# EAGLE board iv17-display-shield (EAGLE 7.5.0)
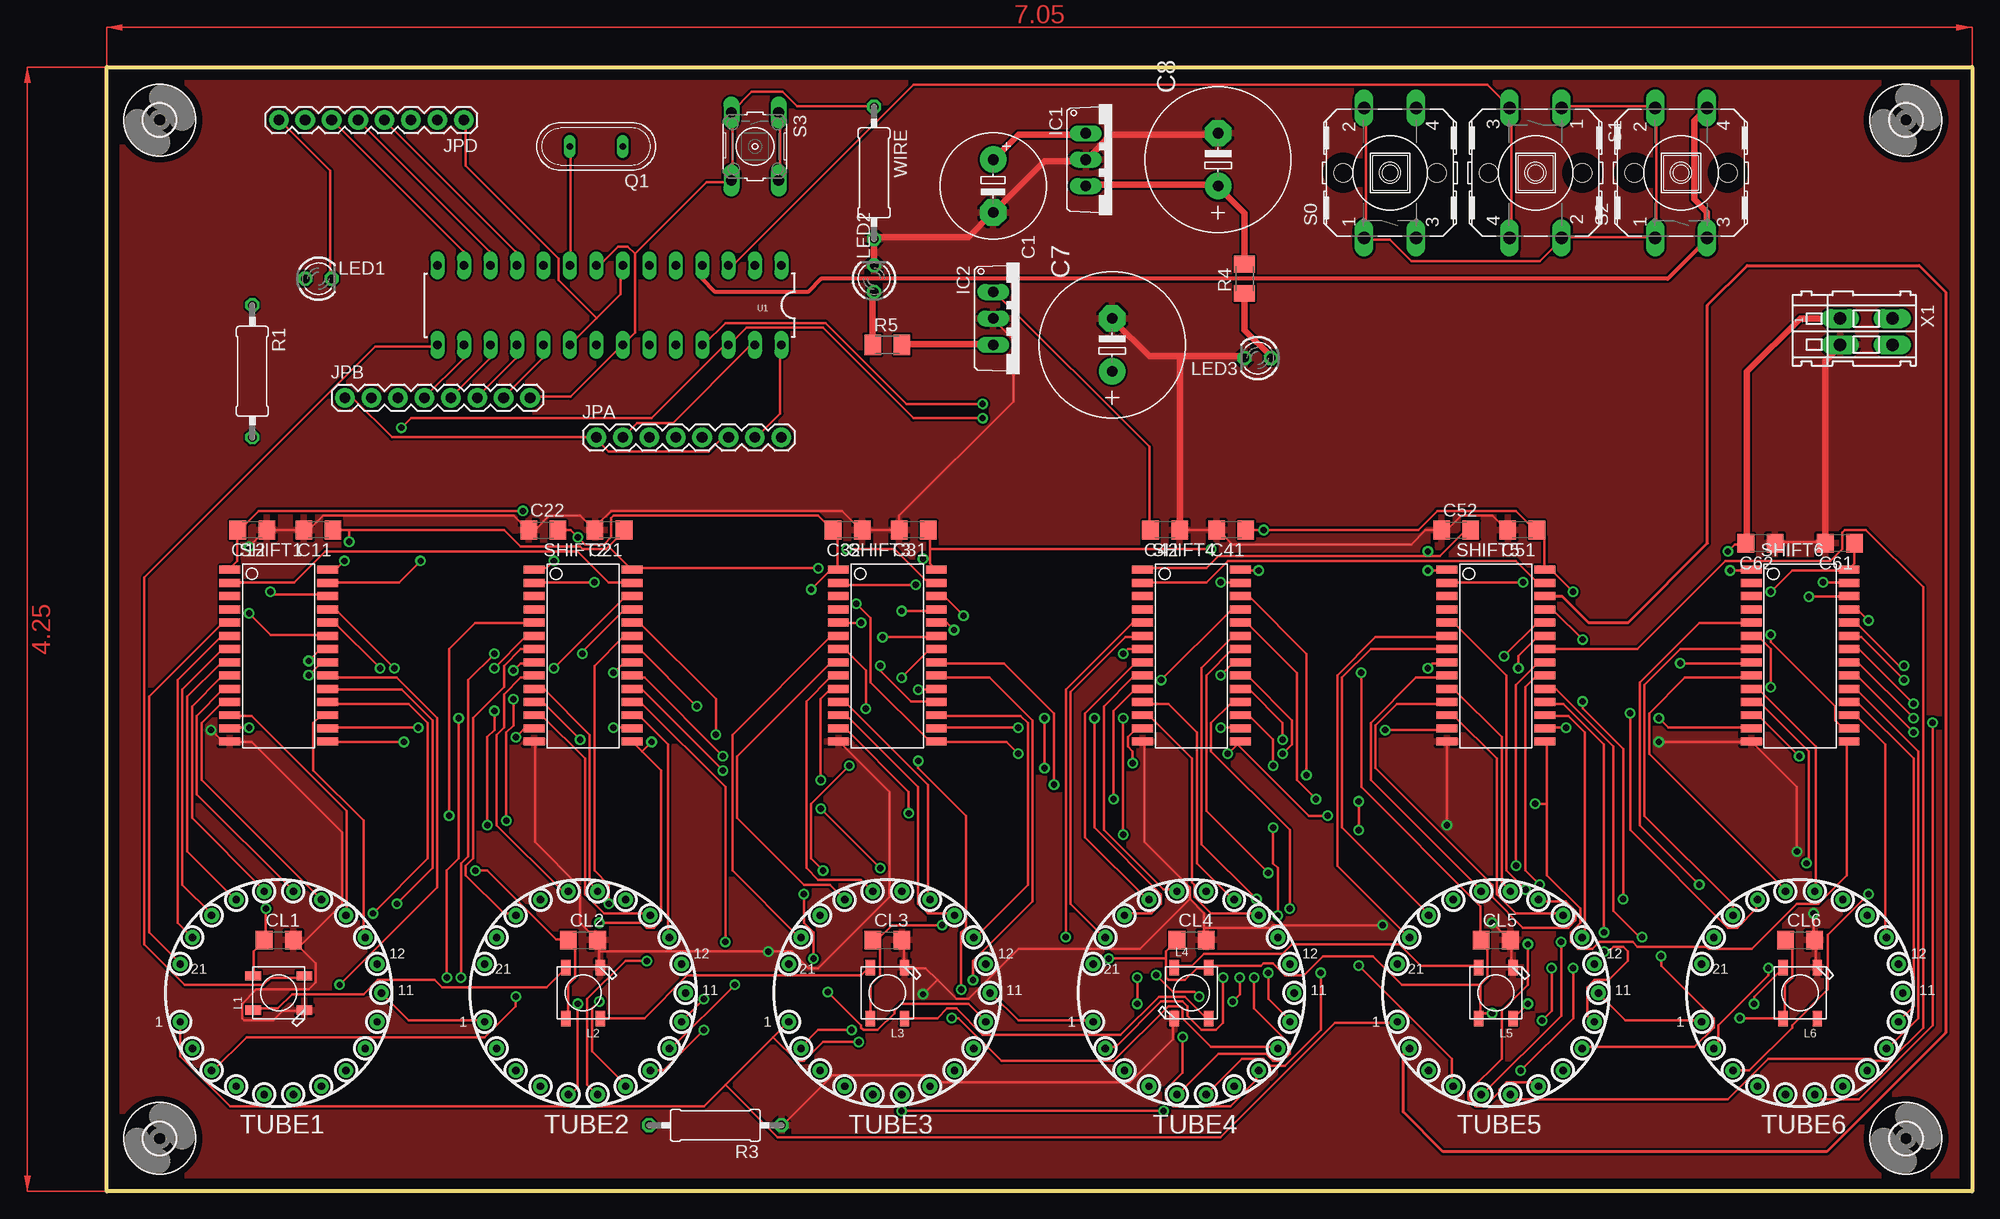
[diagram p2: board, top side]
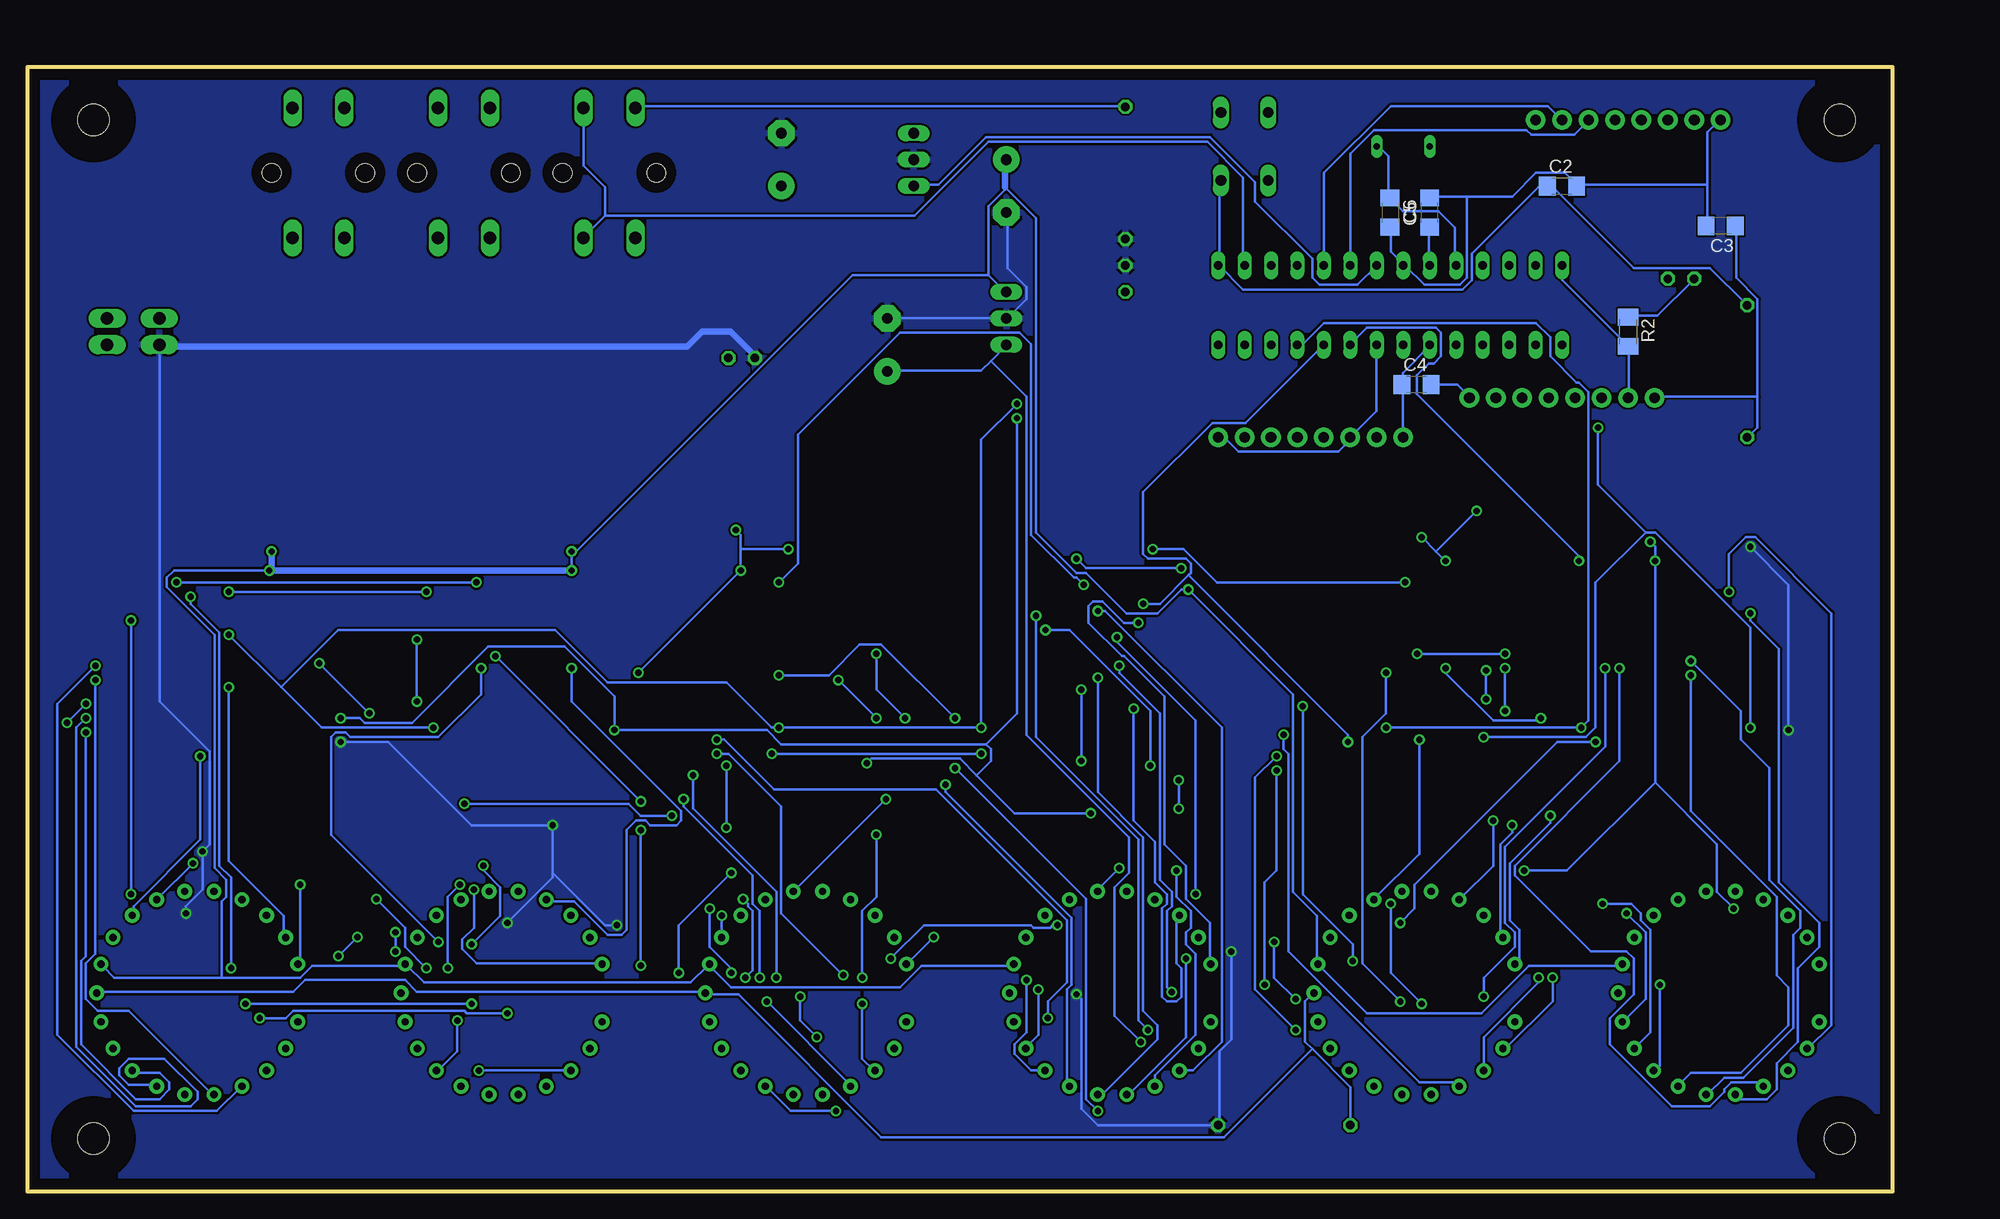
[diagram p3: board, bottom side, seen from below]

Size 179.07 x 107.95 mm. Coordinates in mm from the lower left corner, seen from the top.
Outline: 0,0 0,107.95 179.07,107.95 179.07,0 0,0
Copper layers (1*16): Top 0.035mm / dielectric 1.5mm / Bottom 0.035mm
Design rules "default": minimum track width 10mil, minimum drill 24mil, track to track 8mil, track to pad 8mil, pad to pad 8mil, via to via 8mil, smd to smd 8mil, copper to edge 40mil, drill to drill 8mil, minimum pad ring 10mil, minimum via ring 8mil, stop-mask expansion 4mil, vias tented up to drill 0mil, thermal gap 10mil

## Footprints (pad centres in the part's own frame; a part is rotated, then mirrored left to right if it is on the bottom)
E5-10,5 = drill 1.016 pad 2.54: + -2.54,0 | drill 1.016 pad 2.54 octagon: - 2.54,0
C1206 = smd 1.6 x 1.8: 1 -1.4,0; 2 1.4,0
E5-13 = drill 1.016 pad 2.54: + -2.54,0 | drill 1.016 pad 2.54 octagon: - 2.54,0
TO220V = drill 1.016 long: 1 -2.54,-2.54; 2 0,-2.54; 3 2.54,-2.54
1X08_ROUND = drill 1.016 pad 1.88: 1 0,0; 2 2.54,0; 3 5.08,0; 4 7.62,0; 5 10.16,0; 6 12.7,0; 7 15.24,0; 8 17.78,0
WS2812B = smd 1.5 x 0.9: 1-VDD 2.45,-1.65; 2-DOUT 2.45,1.65; 3-GND -2.45,1.65; 4-DIN -2.45,-1.65
LED3MM = drill 0.813 octagon: A -1.27,0; K 1.27,0
QS = drill 0.61 long: 1 -2.54,0; 2 2.54,0
0309/12 = drill 0.813 octagon: 1 -6.35,0; 2 6.35,0
M1206 = smd 1.6 x 2: 1 -1.4,0; 2 1.4,0
B3F-40XX = drill 1.194 long: 1 -6.248,2.489; 2 6.248,2.489; 3 -6.248,-2.489; 4 6.248,-2.489 | hole 1.803: 0,-4.496; 0,4.496
B3F-10XX = drill 1.016 long: 1 -3.251,2.261; 2 3.251,2.261; 3 -3.251,-2.261; 4 3.251,-2.261
SOIC-28W = smd 0.762 x 2: 1 -8.89,-4.7; 2 -7.62,-4.7; 3 -6.35,-4.7; 4 -5.08,-4.7; 5 -3.81,-4.7; 6 -2.54,-4.7; 7 -1.27,-4.7; 8 0,-4.7; 9 1.27,-4.7; 10 2.54,-4.7; 11 3.81,-4.7; 12 5.08,-4.7; 13 6.35,-4.7; 14 7.62,-4.7; 15 7.62,4.7; 16 6.35,4.7; 17 5.08,4.7; 18 3.81,4.7; 19 2.54,4.7; 20 1.27,4.7; 21 0,4.7; 22 -1.27,4.7; 23 -2.54,4.7; 24 -3.81,4.7; 25 -5.08,4.7; 26 -6.35,4.7; 27 -7.62,4.7; 28 -8.89,4.7
NIXIE-22 = drill 0.7 pad 1.422: 1 -9.451,-2.775; 2 -8.287,-5.325; 3 -6.45,-7.444; 4 -4.092,-8.96; 5 -1.402,-9.75; 6 1.402,-9.75; 7 4.092,-8.96; 8 6.45,-7.444; 9 8.287,-5.325; 10 9.451,-2.775; 11 9.85,0; 12 9.451,2.775; 13 8.287,5.325; 14 6.45,7.444; 15 4.092,8.96; 16 1.402,9.75; 17 -1.402,9.75; 18 -4.092,8.96; 19 -6.45,7.444; 20 -8.287,5.325; 21 -9.451,2.775
DIL28-3 = drill 0.813 long: 1 -16.51,-3.81; 2 -13.97,-3.81; 3 -11.43,-3.81; 4 -8.89,-3.81; 5 -6.35,-3.81; 6 -3.81,-3.81; 7 -1.27,-3.81; 8 1.27,-3.81; 9 3.81,-3.81; 10 6.35,-3.81; 11 8.89,-3.81; 12 11.43,-3.81; 13 13.97,-3.81; 14 16.51,-3.81; 15 16.51,3.81; 16 13.97,3.81; 17 11.43,3.81; 18 8.89,3.81; 19 6.35,3.81; 20 3.81,3.81; 21 1.27,3.81; 22 -1.27,3.81; 23 -3.81,3.81; 24 -6.35,3.81; 25 -8.89,3.81; 26 -11.43,3.81; 27 -13.97,3.81; 28 -16.51,3.81
3,0 = hole 3: 0,0
233-102 = drill 1.2 long: A1 -1.25,2.5; A2 1.25,2.5; B1 -1.25,-2.5; B2 1.25,-2.5

## Placement (x,y rotation side)
C1  470uf  [E5-10,5]  85.09,96.52 270 top
C2  0.1uF  [C1206]  31.75,96.52 0 bottom
C3  0.1uF  [C1206]  16.51,92.71 180 bottom
C4  0.1uF  [C1206]  45.72,77.47 0 bottom
C5  6pF  [C1206]  44.45,93.98 90 bottom
C6  6pF  [C1206]  48.26,93.98 270 bottom
C7  [E5-13]  96.52,81.28 90 top
C8  [E5-13]  106.68,99.06 90 top
C11  100nf  [C1206]  20.32,63.5 180 top
C12  100nf  [C1206]  13.97,63.5 180 top
C21  100nf  [C1206]  48.26,63.5 180 top
C22  100nf  [C1206]  41.91,63.5 0 top
C31  100nf  [C1206]  77.47,63.5 180 top
C32  100nf  [C1206]  71.12,63.5 180 top
C41  100nf  [C1206]  107.95,63.5 180 top
C42  100nf  [C1206]  101.6,63.5 180 top
C51  100nf  [C1206]  135.89,63.5 180 top
C52  100nf  [C1206]  129.54,63.5 0 top
C61  100nf  [C1206]  166.37,62.23 180 top
C62  100nf  [C1206]  158.75,62.23 180 top
CL1  100nf  [C1206]  16.51,24.13 0 top
CL2  100nf  [C1206]  45.72,24.13 0 top
CL3  100nf  [C1206]  74.93,24.13 0 top
CL4  100nf  [C1206]  104.14,24.13 0 top
CL5  100nf  [C1206]  133.35,24.13 0 top
CL6  100nf  [C1206]  162.56,24.13 0 top
IC1  MURATA 5V  [TO220V]  96.52,99.06 270 top
IC2  MURATA 5V  [TO220V]  87.63,83.82 270 top
JPA  [1X08_ROUND]  46.99,72.39 0 top
JPB  [1X08_ROUND]  22.86,76.2 0 top
JPD  [1X08_ROUND]  34.29,102.87 180 top
L1  WS2812B  [WS2812B]  16.51,19.05 180 top
L2  WS2812B  [WS2812B]  45.72,19.05 270 top
L3  WS2812B  [WS2812B]  74.93,19.05 270 top
L4  WS2812B  [WS2812B]  104.14,19.05 90 top
L5  WS2812B  [WS2812B]  133.35,19.05 270 top
L6  WS2812B  [WS2812B]  162.56,19.05 270 top
LED1  heart  [LED3MM]  20.32,87.63 0 top
LED2  5vfil  [LED3MM]  73.66,87.63 90 top
LED3  5v1  [LED3MM]  110.49,80.01 180 top
Q1  [QS]  46.99,100.33 180 top
R1  4.7K  [0309/12]  13.97,78.74 270 top
R2  [M1206]  25.4,82.55 270 bottom
R3  [0309/12]  58.42,6.35 180 top
R4  [M1206]  109.22,87.63 90 top
R5  [M1206]  74.93,81.28 0 top
S0  [B3F-40XX]  123.19,97.79 90 top
S1  [B3F-40XX]  137.16,97.79 270 top
S2  [B3F-40XX]  151.13,97.79 90 top
S3  [B3F-10XX]  62.23,100.33 270 top
SHIFT1  MAX6921  [SOIC-28W]  16.51,50.8 270 top
SHIFT2  MAX6921  [SOIC-28W]  45.72,50.8 270 top
SHIFT3  MAX6921  [SOIC-28W]  74.93,50.8 270 top
SHIFT4  MAX6921  [SOIC-28W]  104.14,50.8 270 top
SHIFT5  MAX6921  [SOIC-28W]  133.35,50.8 270 top
SHIFT6  MAX6921  [SOIC-28W]  162.56,50.8 270 top
TUBE1  IV17  [NIXIE-22]  16.51,19.05 0 top
TUBE2  IV17  [NIXIE-22]  45.72,19.05 0 top
TUBE3  IV17  [NIXIE-22]  74.93,19.05 0 top
TUBE4  IV17  [NIXIE-22]  104.14,19.05 0 top
TUBE5  IV17  [NIXIE-22]  133.35,19.05 0 top
TUBE6  IV17  [NIXIE-22]  162.56,19.05 0 top
U1  ATMEGA328P_PDIP  [DIL28-3]  48.26,85.09 180 top
U$1  [3,0]  172.72,102.87 0 top
U$2  [3,0]  172.72,5.08 0 top
U$3  [3,0]  5.08,102.87 0 top
U$4  [3,0]  5.08,5.08 0 top
WIRE  wire  [0309/12]  73.66,97.79 270 top
X1  24vdc  [233-102]  168.91,82.55 270 top

## Tracks (layer width: path | path; a pad name or v marks a point on that pad's centre or on a via)
5VDC  (via drill 0.61)
  Top 0.254: CL6.1 161.34,23.95 161.8,23.49 161.8,20.52 161.11,19.84 161.11,16.64 L6.1-VDD 160.88,16.64 v156.77,16.64 | L3.1-VDD 73.33,16.64 73.33,19.84 74.24,20.75 74.24,23.27 73.56,23.95 CL3.1 73.56,24.18 74.02,24.18 75.39,25.55 v80.19,25.55 | 101.68,22.35 101.68,23.04 102.59,23.95 CL4.1 | 101.68,22.35 101.68,20.52 101.91,20.3 103.5,20.3 104.65,21.44 105.56,21.44 L4.1-VDD 105.79,21.67 110.82,21.67 111.05,21.89 111.96,21.89 113.11,20.75 114.93,20.75 116.76,22.58 121.56,22.58 124.31,19.84 131.85,19.84 | 131.85,19.84 131.85,17.09 | 131.85,17.09 131.85,16.64 L5.1-VDD 131.85,17.09 | 131.85,19.84 132.54,20.52 132.54,23.49 132.08,23.95 CL5.1 131.85,24.18 131.85,27.38 120.42,38.81 v120.42,49.78 | 101.68,22.35 v96.19,22.35 | 131.85,17.09 v132.99,17.09 | L2.1-VDD 44.3,16.64 44.3,19.84 44.98,20.52 44.98,23.49 44.53,23.95 CL2.1 44.3,24.18 43.16,24.18 36.52,30.81 v35.38,30.81 | L1.1-VDD 14.12,20.75 14.12,23.04 15.04,23.95 CL1.1 15.26,24.18 v15.26,27.15 | 23.27,63.5 38.12,63.5 39.73,61.9 45.44,61.9 45.67,61.67 47.95,61.67 48.18,61.9 | 23.27,63.5 C11.1 | 48.18,61.9 49.78,63.5 C21.1 | v22.81,60.53 22.12,59.84 21.44,59.84 SHIFT1.28 | 23.27,63.5 v23.27,62.36 | 48.18,61.9 50.24,59.84 SHIFT2.28 50.47,59.84 v68.3,59.84 | 79.04,60.76 79.04,60.3 79.5,59.84 SHIFT3.28 | 79.04,60.76 79.04,61.67 | 79.04,61.67 79.04,63.5 C31.1 | C61.1 167.74,62.13 167.74,60.3 167.28,59.84 SHIFT6.28 167.06,59.61 161.8,59.61 v159.74,57.56 | C41.1 v111.05,63.5 125.91,63.5 127.74,65.33 135.28,65.33 137.11,63.5 C51.1 137.34,63.5 138.02,62.81 138.02,59.84 SHIFT5.28 138.25,59.61 138.71,59.61 v140.77,57.56
  Top 0.254: v110.59,59.61 108.99,59.61 SHIFT4.28 | v106.02,61.67 79.04,61.67 | 79.04,60.76 v78.36,60.76
  Bottom 0.254: v80.19,25.55 80.64,25.55 80.87,25.32 82.47,25.32 82.7,25.55 92.99,25.55 v96.19,22.35 | v156.77,16.64 154.25,16.64 153.57,17.32 137.11,17.32 136.88,17.09 v132.99,17.09 | v23.27,62.36 22.81,61.9 v22.81,60.53 22.81,39.27 | v15.26,27.15 16.87,28.75 16.87,33.33 22.81,39.27 | v35.38,30.81 31.27,30.81 22.81,39.27 | 110.59,61.67 110.59,63.04 v111.05,63.5 | 110.59,61.67 v110.59,59.61 v120.42,49.78 | v140.77,57.56 v159.74,57.56 | 110.59,61.67 v106.02,61.67 | v68.3,59.84 77.44,59.84 v78.36,60.76
24VDC  (via drill 0.61)
  Top 0.254: SHIFT1.1 11.84,59.84 12.52,60.53 12.52,63.5 C12.2 12.75,63.5 14.58,65.33 v39.95,65.33 | C22.2 44.53,63.5 v45.21,62.81 45.9,62.13 47.73,62.13 48.41,62.81 48.41,64.64 48.64,64.87 68.3,64.87 69.67,63.5 C32.2 69.9,63.5 70.13,63.27 70.13,59.84 SHIFT3.1 70.13,59.61 69.44,59.61 v67.61,57.79 | v42.93,60.53 42.24,59.84 41.1,59.84 SHIFT2.1 | 93.9,101.45 IC1.1 | 85.22,99.16 C1.+ | C42.2 100.08,63.5 100.08,71.5 85.22,86.36 IC2.1 | 157.45,62.36 C62.2 157.23,62.13 156.31,62.13 v155.63,61.44 | C52.2 130.48,63.5 127.96,60.98 126.82,60.98 | 126.82,60.98 106.7,60.98 105.56,59.84 99.62,59.84 SHIFT4.1 | v126.82,59.61 128.42,59.61 SHIFT5.1 | 126.82,60.98 v126.82,61.44 | v155.85,59.61 157.68,59.61 SHIFT6.1
  Top 0.61: 93.9,101.45 87.5,101.45 85.22,99.16 | 157.45,62.36 157.45,78.71 162.56,83.82 166.39,83.82 X1.B1
  Bottom 0.254: TUBE1.12 26.01,21.67 34.92,21.67 39.5,17.09 50.47,17.09 55.04,21.67 TUBE2.12 55.27,21.89 55.27,26.47 57.56,28.75 57.56,47.73 v67.61,57.79 68.3,57.79 70.59,55.5 73.56,55.5 77.44,59.38 78.36,59.38 82.24,63.27 82.24,93.45 85.22,96.42 85.22,96.19 86.82,94.59 86.82,87.96 | v45.21,62.81 43.84,61.44 | 43.84,61.44 v42.93,60.53 | 43.84,61.44 v39.95,65.33 | 160.43,20.52 170.71,20.52 171.86,21.67 TUBE6.12 | 160.43,20.52 152.88,20.52 151.74,21.67 142.82,21.67 TUBE5.12 142.6,21.67 141,20.07 115.39,20.07 113.79,21.67 TUBE4.12 113.56,21.67 111.51,19.61 95.27,19.61 93.22,21.67 84.53,21.67 TUBE3.12 | 86.82,87.96 85.22,86.36 IC2.1 | 85.22,98.93 C1.+ | 126.82,60.98 v126.82,59.61 | 155.63,59.61 v155.85,59.61 165,59.61 165.68,58.93 165.68,58.01 161.11,53.44 161.11,31.04 159.97,29.9 159.97,28.3 160.43,27.84 160.43,20.52 | 86.82,87.96 99.85,87.96 126.82,60.98 | 126.82,60.98 v126.82,61.44
  Bottom 0.61: 85.22,96.42 85.22,98.93 | v126.82,59.61 155.63,59.61 v155.63,61.44
AGND  (via drill 0.61)
  Top 0.254: L4.3-GND 102.36,16.41 102.36,14.58 98.25,10.46 80.19,10.46 79.5,11.15 69.67,11.15 64.87,6.35 R3.1 | 47.27,23.04 47.27,23.95 CL2.2 47.04,24.18 45.44,25.78 45.44,29.21 41.1,33.55 41.1,43.16 SHIFT2.14 | 47.27,23.04 47.27,21.67 L2.3-GND | 47.27,23.04 v63.5,23.04 65.79,23.04 67.39,21.44 68.3,21.44 75.16,28.3 75.16,38.35 70.36,43.16 SHIFT3.14 | CL3.2 76.53,23.95 76.53,21.67 L3.3-GND 76.76,21.44 78.59,21.44 79.73,20.3 | 105.33,25.32 105.33,26.7 103.96,28.07 | 105.33,25.32 105.33,24.18 CL4.2 | 103.96,28.07 103.96,29.21 99.62,33.55 99.62,43.16 SHIFT4.14 | 79.73,20.3 81.56,18.47 82.7,18.47 87.5,23.27 99.16,23.27 103.96,28.07 | C62.1 160.2,62.36 164.77,62.36 C61.2 165,62.36 | 166.37,81.1 X1.B2 | L6.3-GND 164.08,21.67 164.08,23.95 CL6.2 163.85,24.18 v163.85,26.7 | L5.3-GND 134.82,21.67 134.82,23.95 CL5.2 134.59,24.18 v132.99,25.78 | v128.65,35.15 128.65,43.16 SHIFT5.14 | v149,43.16 157.68,43.16 SHIFT6.14 157.91,43.16 162.25,38.81 v162.25,32.64 | 105.33,25.32 111.73,25.32 111.96,25.55 v122.48,25.55 | 79.73,20.3 v78.36,18.92 | C51.2 134.37,63.5 132.99,64.87 130.02,64.87 128.65,63.5 C52.1 126.59,63.5 125.22,62.13 108.08,62.13 106.7,63.5 C41.2 103.05,63.5 C42.1 | 109.22,80.19 LED3.K | 96.65,83.62 C7.- | 93.9,98.93 IC1.2 94.13,99.16 | 85.22,94.13 C1.- 84.99,93.9 | 73.79,91.62 WIRE.2 | 106.48,101.45 C8.- | 18.47,23.49 18.01,23.95 CL1.2 18.47,23.49 | 18.47,23.49 20.07,21.89 20.07,20.07 19.38,19.38 14.35,19.38 12.98,18.01 12.98,16.64 13.21,16.41 15.95,16.41 16.87,17.32 18.92,17.32 L1.3-GND | 18.47,23.49 22.58,27.61 22.58,34.47 13.89,43.16 11.84,43.16 SHIFT1.14 11.61,43.38 10.92,43.38 v10.01,44.3
  Top 0.254: IC2.2 85.22,83.62 87.05,81.79 87.05,75.84 76.07,64.87 C31.2 C32.1 72.41,63.5 70.59,65.33 48.41,65.33 47.04,63.96 47.04,63.5 C21.2 46.81,63.5 45.44,64.87 42.47,64.87 41.1,63.5 C22.1 40.41,63.5 39.04,64.87 20.75,64.87 19.38,63.5 C11.2 C12.1 15.26,63.5 v13.66,61.9
  Top 0.61: 165,62.36 165,79.73 166.37,81.1 | 103.05,80.19 100.08,80.19 96.65,83.62 | 103.05,80.19 109.22,80.19 | 103.05,80.19 103.05,63.5 | 93.9,98.93 90.02,98.93 85.22,94.13 | 73.79,91.62 82.7,91.62 84.99,93.9 | 106.48,101.45 96.42,101.45 94.13,99.16 | LED2.K WIRE.2
  Bottom 0.254: v63.5,23.04 63.5,14.58 64.64,13.44 64.64,6.35 R3.1 76.3,6.35 77.9,7.95 77.9,18.47 v78.36,18.92 | 128.65,30.58 128.65,30.12 v132.99,25.78 | 128.65,30.58 v128.65,35.15 136.42,35.15 144.42,43.16 v149,43.16 | v163.85,26.7 163.85,27.38 162.25,28.98 v162.25,32.64 161.57,33.33 161.57,42.24 166.37,47.04 166.37,81.1 X1.B2 | v122.48,25.55 123.62,25.55 128.65,30.58 | v10.01,44.3 10.01,58.24 v13.66,61.9 | C1.- 84.99,93.9 84.99,88.65 83.16,86.82 83.16,85.67 84.99,83.84 IC2.2 85.22,83.84 96.42,83.84 C7.- | 109.22,80.19 LED3.K
  Bottom 0.61: 166.37,81.1 115.75,81.1 114.3,82.55 111.58,82.55 109.22,80.19
  pour Top: 0,0 0,107.95 179.07,107.95 179.07,0
  pour Bottom: 0,0 0,107.95 179.07,107.95 179.07,0
BLANK  (via drill 0.61)
  Top 0.254: v13.66,44.53 11.84,44.53 SHIFT1.13 | v39.27,43.61 39.95,44.3 40.87,44.3 SHIFT2.13 | v28.3,73.33 29.21,74.24 52.3,74.24 59.16,81.1 59.61,81.1 U1.26 59.84,81.33 61.44,82.93 68.76,82.93 77.44,74.24 v84.07,74.24 | v76.99,36.3 76.99,38.35 71.04,44.3 70.36,44.3 SHIFT3.13 | v98.48,41.1 98.48,42.24 98.02,42.7 98.02,43.61 98.7,44.3 99.39,44.3 SHIFT4.13 | v122.71,44.3 128.42,44.3 SHIFT5.13 | v149,45.44 149.91,44.53 157.68,44.53 SHIFT6.13
  Bottom 0.254: v13.66,44.53 13.66,54.13 22.81,63.27 23.72,63.27 | 23.72,63.27 28.52,58.47 28.52,44.53 29.44,43.61 v39.27,43.61 | v28.3,73.33 28.3,67.84 23.72,63.27 | v76.99,36.3 84.3,36.3 87.96,39.95 | 87.96,39.95 89.56,41.55 98.02,41.55 v98.48,41.1 | 87.05,42.93 106.7,42.93 108.08,44.3 v122.71,44.3 122.71,47.5 127.51,52.3 134.82,52.3 142.14,44.98 146.71,44.98 147.17,45.44 v149,45.44 | 87.05,42.93 86.59,42.47 86.59,41.33 87.96,39.95 | v84.07,74.24 84.07,45.9 87.05,42.93
CLK  (via drill 0.61)
  Top 0.254: 138.25,37.21 138.25,30.35 141.45,27.15 141.45,25.78 140.54,24.87 140.54,23.95 141.22,23.27 142.6,23.27 143.28,23.95 146.48,23.95 146.94,23.49 153.57,23.49 153.8,23.27 157.91,23.27 162.25,27.61 164.31,27.61 167.06,30.35 167.06,43.16 SHIFT6.15 | 138.25,37.21 138.25,43.16 SHIFT5.15 | v28.52,43.16 21.44,43.16 SHIFT1.15 | v47.27,25.78 51.38,25.78 51.84,25.32 52.53,25.32 53.21,26.01 53.21,40.41 51.38,42.24 | 51.38,42.24 50.47,43.16 SHIFT2.15 | v87.5,42.01 86.36,43.16 79.73,43.16 SHIFT3.15 79.5,43.38 78.82,43.38 73.33,48.87 73.33,55.04 v71.96,56.41 | 108.53,42.93 108.76,43.16 SHIFT4.15 108.53,42.93 | 108.53,42.93 v107.62,42.01 | v52.3,43.16 51.38,42.24 | v137.11,37.21 138.25,37.21 | v117.22,36.07 115.39,36.07 108.53,42.93
  Bottom 0.254: v28.52,43.16 32.18,43.16 45.9,29.44 45.9,27.15 v47.27,25.78 | v107.62,42.01 v87.5,42.01 | 67.61,59.16 70.36,56.41 v71.96,56.41 | 67.61,59.16 67.39,59.38 67.39,60.3 67.84,60.76 71.5,60.76 71.96,61.21 71.96,67.16 65.33,73.79 62.13,73.79 54.81,81.1 U1.24 | v52.3,43.16 52.3,43.84 67.61,59.16 | v137.11,37.21 121.34,37.21 120.19,36.07 v117.22,36.07
DATA  (via drill 0.61)
  Top 0.254: v30.12,60.53 28.07,58.47 21.44,58.47 SHIFT1.27
  Bottom 0.254: v30.12,60.53 30.12,60.98 45.67,76.53 45.67,78.36 44.53,79.5 44.07,79.5 43.38,80.19 43.38,82.47 43.84,82.93 50.47,82.93 52.07,81.33 U1.23
GND
  Top 0.254: LED1.K 21.44,87.73 21.44,98.02 16.64,102.82 JPD.8 | S0.2 120.88,103.96 120.88,91.62 S0.1 120.88,91.39 123.16,91.39 125.22,89.33 137.57,89.33 139.62,91.39 S1.2 139.85,91.62 148.54,91.62 S2.1 148.77,91.62 148.77,103.96 S2.2 148.54,104.19 139.85,104.19 S1.1 | WIRE.1 73.56,104.19 66.24,104.19 64.87,105.56 61.9,105.56 60.07,103.73 S3.3 60.07,103.5 60.07,97.1 S3.4 59.84,96.88 57.56,96.88 50.7,90.02 | 50.7,90.02 50.01,90.7 49.1,90.7 47.5,89.1 47.04,89.1 U1.8 | 50.7,90.02 50.7,82.47 49.55,81.33 U1.22 49.33,81.1 44.53,76.3 40.64,76.3 JPB.8
  Bottom 0.254: 17.78,96.65 17.78,101.68 16.64,102.82 JPD.8 | 17.78,96.65 17.78,92.76 C3.2 | 17.78,96.65 30.12,96.65 C2.2 30.35,96.65 31.5,97.79 34.24,97.79 36.52,95.5 40.87,95.5 | 40.87,95.5 44.3,95.5 C5.2 | C4.2 44.3,77.44 41.78,77.44 40.64,76.3 JPB.8 | C6.2 48.18,92.53 48.18,90.25 47.04,89.1 U1.8 46.81,88.88 44.98,87.05 41.55,87.05 40.87,87.73 40.87,95.5 | U1.22 49.55,81.1 49.55,74.93 52.07,72.41 JPA.3 52.07,72.19 53.21,71.04 62.81,71.04 63.96,72.19 64.64,72.19 JPA.8 | S0.2 120.65,104.19 73.79,104.19 WIRE.1
LED-DATA
  Top 0.254: L1.4-DIN 18.92,20.52 15.72,20.52 15.04,19.84 7.49,19.84 3.61,23.72 3.61,58.93 25.78,81.1 31.73,81.1 U1.15
LOAD  (via drill 0.61)
  Top 0.254: v29.9,44.53 21.44,44.53 SHIFT1.16 | v48.64,44.53 50.24,44.53 SHIFT2.16 | v87.5,44.53 79.73,44.53 SHIFT3.16 | v106.93,44.53 108.76,44.53 SHIFT4.16 | v140.08,44.53 138.25,44.53 SHIFT5.16 | v159.74,53.44 159.74,52.76 165.91,46.58 165.91,45.21 166.6,44.53 167.06,44.53 SHIFT6.16 | v84.07,75.62 76.76,75.62 68.99,83.39 59.38,83.39 57.33,81.33 U1.25
  Bottom 0.254: v48.64,44.53 v29.9,44.53 29.21,45.21 29.21,76.76 30.12,77.67 30.35,77.67 32.87,80.19 32.87,82.02 34.24,83.39 54.59,83.39 56.64,81.33 57.1,81.33 U1.25 | v140.08,44.53 150.82,44.53 154.71,48.41 | v159.74,53.44 154.71,48.41 | 154.71,48.41 149.22,53.9 128.42,53.9 123.39,48.87 111.96,48.87 107.62,44.53 v106.93,44.53 v87.5,44.53 87.5,72.19 v84.07,75.62
N$1
  Top 0.254: SHIFT1.2 11.84,58.47 18.01,58.47 20.98,61.44 45.21,61.44 48.18,58.47 50.24,58.47 SHIFT2.27
N$2
  Top 0.254: TUBE6.1 152.88,16.41 145.8,16.41 143.28,18.92 TUBE5.11
N$3  (via drill 0.61)
  Top 0.254: v46.81,58.47 41.1,58.47 SHIFT2.2 | v71.04,61.67 75.62,61.67 78.82,58.47 79.5,58.47 SHIFT3.27
  Bottom 0.254: v46.81,58.47 64.87,58.47 68.07,61.67 v71.04,61.67
N$4  (via drill 0.61)
  Top 0.254: v77.67,58.24 70.36,58.24 SHIFT3.2 | v106.93,58.47 108.76,58.47 SHIFT4.27
  Bottom 0.254: v77.67,58.24 78.36,58.93 78.59,58.93 82.7,63.04 82.7,81.33 83.84,82.47 95.27,82.47 105.1,72.64 105.1,60.3 v106.93,58.47
N$5
  Top 0.254: SHIFT4.2 99.62,58.47 105.56,58.47 107.62,60.53 135.28,60.53 137.34,58.47 138.02,58.47 SHIFT5.27
N$6  (via drill 0.61)
  Top 0.254: v135.97,58.47 128.65,58.47 SHIFT5.2 | v164.77,58.47 167.06,58.47 SHIFT6.27
  Bottom 0.254: v164.77,58.47 v135.97,58.47
N$7
  Top 0.254: S3.1 64.64,103.5 64.64,97.1 S3.2
  Bottom 0.254: S3.2 64.64,96.88 64.64,89.1 U1.1 64.64,88.88 62.36,86.59 41.33,86.59 40.41,87.5 40.41,90.02 34.01,96.42 33.33,96.42 C2.1 33.1,96.42 32.64,96.42 24.87,88.65 17.55,88.65 14.12,85.22 R1.1
N$8
  Bottom 0.254: 123.62,93.67 93.9,93.67 86.82,100.76 65.79,100.76 62.36,97.33 62.36,89.1 U1.2 | 123.62,93.67 125.68,91.62 S0.3 | S0.4 125.68,98.48 123.62,96.42 123.62,93.67
N$9
  Top 0.254: Q1.2 44.53,100.3 44.53,89.1 U1.9
  Bottom 0.254: C5.1 44.53,92.53 44.53,89.1 U1.9
N$10
  Top 0.254: U1.3 59.84,89.1 60.3,89.1 77.44,106.25 132.54,106.25 134.59,104.19 S1.3 134.82,103.96 134.82,91.62 S1.4
N$11
  Top 0.406: U1.4 57.15,87.63 58.42,86.36 67.31,86.36 68.58,87.63 149.86,87.63 153.62,91.39 S2.3
  Top 0.61: S2.3 153.62,94.03 152.4,95.25 152.4,102.82 S2.4
N$12
  Bottom 0.254: R3.2 52.07,10.01 55.73,13.66 | 55.73,13.66 56.41,14.35 56.41,18.24 55.73,18.92 TUBE2.11 | TUBE6.11 172.31,19.15 153.57,19.15 152.42,20.3 142.82,20.3 141.68,19.15 114.02,19.15 TUBE4.11 113.79,18.92 110.82,18.92 97.1,5.21 64.19,5.21 55.73,13.66
N$13
  Bottom 0.254: Q1.1 49.33,100.3 48.41,99.39 48.41,95.5 C6.1 48.18,95.27 47.04,94.13 43.61,94.13 42.01,92.53 42.01,89.1 U1.10
N$14
  Bottom 0.254: R2.1 25.32,84.07 22.58,84.07 19.15,87.5 LED1.A
N$15
  Top 0.406: LED2.A 73.53,86.36
  Top 0.61: 73.53,86.36 R5.1
N$16
  Top 0.254: 111.73,80.19 LED3.A
  Top 0.61: R4.1 109.22,82.7 111.73,80.19
N$76
  Top 0.305: TUBE5.2 124.46,13.12 124.46,7.62 128.27,3.81 165.1,3.81 176.53,15.24 176.53,86.36 173.99,88.9 157.48,88.9 153.67,85.09 153.67,62.23 146.05,54.61 142.24,54.61 139.7,57.15 138.43,57.15
  Top 0.406: SHIFT5.26 138.43,57.15
N$77  (via drill 0.61)
  Top 0.254: v141.68,52.98 138.94,55.73 138.25,55.73 SHIFT5.25 | v141.68,47.04 141.68,46.36 145.57,42.47 v145.57,28.07 | v140.77,21.44 140.77,16.64 v135.74,11.61
  Bottom 0.254: v141.68,47.04 v141.68,52.98 | v145.57,28.07 142.82,25.32 142.82,23.49 v140.77,21.44 | v135.74,11.61 127.05,11.61 TUBE5.3
N$78  (via drill 0.61)
  Top 0.254: v134.14,51.38 137.34,54.59 138.02,54.59 SHIFT5.24 | v120.19,34.7 v120.19,37.44 | v120.19,21.67 129.11,12.75 129.11,10.24 TUBE5.4
  Bottom 0.254: v120.19,37.44 v134.14,51.38 | v120.19,21.67 v120.19,34.7
N$79  (via drill 0.61)
  Top 0.254: v135.51,50.24 135.51,51.38 137.34,53.21 138.02,53.21 SHIFT5.23 | v139.62,23.95 139.62,16.87 132.08,9.32 TUBE5.5
  Bottom 0.254: v135.51,50.24 135.51,47.73 139.62,43.61 148.08,43.61 148.54,44.07 149.45,44.07 149.91,43.61 149.91,34.24 v139.62,23.95
N$80
  Top 0.254: SHIFT5.22 146.94,52.07 155.4,60.53 165.46,60.53 166.6,61.67 166.6,63.27 166.83,63.5 168.88,63.5 174.37,58.01 174.37,15.72 171.17,12.52 169.57,12.52 169.34,12.75 159.51,12.75 155.63,8.87 135.05,8.87 134.82,9.09 TUBE5.6
N$81  (via drill 0.61)
  Top 0.254: v135.28,31.27 135.28,48.64 137.34,50.7 138.02,50.7 SHIFT5.21 | v136.42,23.72 136.42,19.84 133.91,17.32 133.91,12.75 130.71,9.55 130.71,8.87 131.39,8.18 132.31,8.18 133.68,9.55 133.68,9.78 134.37,10.46 137.11,10.46 137.34,10.24 TUBE5.7
  Bottom 0.254: v135.28,31.27 135.28,30.81 133.68,29.21 133.68,26.47 v136.42,23.72
N$82  (via drill 0.61)
  Top 0.254: v137.57,29.44 136.19,30.81 136.19,48.41 137.11,49.33 138.02,49.33 SHIFT5.20 | v138.71,21.44 138.71,17.32 v137.79,16.41
  Bottom 0.254: v137.57,29.44 138.71,28.3 v138.71,21.44 | v137.79,16.41 137.79,13.44 139.62,11.61 TUBE5.8
N$83  (via drill 0.61)
  Top 0.254: v147.4,24.41 147.17,24.41 144.65,26.92 144.65,42.7 139.17,48.18 138.25,48.18 SHIFT5.19 | v149.22,22.58 149.22,21.67 154.25,16.64 154.25,15.72 152.42,13.89 141.68,13.89 TUBE5.9
  Bottom 0.254: v149.22,22.58 v147.4,24.41
N$84  (via drill 0.61)
  Top 0.254: v143.74,24.87 143.74,42.93 139.85,46.81 138.25,46.81 SHIFT5.18 | v143.74,23.04 144.2,23.04 144.65,23.49 145.57,23.49 146.03,23.04 146.03,22.12 144.2,20.3 142.82,20.3 142.14,19.61 142.14,16.87 142.6,16.41 TUBE5.10
  Bottom 0.254: v143.74,23.04 v143.74,24.87
N$86
  Top 0.254: SHIFT5.17 138.25,45.67 140.31,45.67 141.91,44.07 141.91,24.64 141.68,24.41 TUBE5.13
N$87
  Top 0.254: SHIFT5.12 128.65,45.67 129.34,45.67 133.45,41.55 133.45,28.52 135.28,26.7 139.62,26.7 TUBE5.14
N$88
  Top 0.254: SHIFT5.11 128.42,46.81 123.85,46.81 121.79,44.76 121.79,40.64 132.99,29.44 132.99,28.3 135.97,25.32 140.31,25.32 141,26.01 141,26.92 140.08,27.84 137.57,27.84 TUBE5.15
N$89
  Top 0.254: SHIFT5.10 128.65,48.18 129.34,48.18 133.91,43.61 133.91,29.67 134.59,28.98 TUBE5.16
N$90
  Top 0.254: SHIFT5.9 128.42,49.33 125.68,49.33 121.34,44.98 121.34,39.5 131.85,28.98 TUBE5.17
N$91  (via drill 0.61)
  Top 0.254: v126.82,50.24 127.28,50.7 128.42,50.7 SHIFT5.8
  Bottom 0.254: v126.82,50.24 126.82,47.04 116.31,36.52 116.31,35.61 116.76,35.15 119.28,35.15 119.74,35.61 120.65,35.61 121.56,34.7 121.56,25.09 122.02,24.64 123.39,24.64 126.59,27.84 129.11,27.84 TUBE5.18
N$92
  Top 0.254: SHIFT5.7 121.34,52.07 118.59,49.33 118.59,34.92 126.82,26.7 TUBE5.19
N$93
  Top 0.254: SHIFT5.6 128.42,53.21 121.79,53.21 118.13,49.55 118.13,31.27 124.99,24.41 TUBE5.20
N$94  (via drill 0.61)
  Top 0.254: v136.19,28.98 134.37,30.81 134.37,49.55 129.34,54.59 128.65,54.59 SHIFT5.5
  Bottom 0.254: v136.19,28.98 136.19,25.32 137.34,24.18 137.34,23.27 135.97,21.89 124.08,21.89 TUBE5.21
N$95  (via drill 0.61)
  Top 0.254: v163.4,57.1 167.06,57.1 SHIFT6.26 | v159.51,21.44 159.51,20.75 154.71,15.95 154.71,14.12 154.48,13.89 TUBE6.2
  Bottom 0.254: v163.4,57.1 163.4,56.41 160.66,53.67 160.66,31.27 159.51,30.12 v159.51,21.44
N$96  (via drill 0.61)
  Top 0.254: v169.11,54.81 168.2,55.73 167.28,55.73 SHIFT6.25 | v169.11,28.52 165.23,24.64 165.23,19.38 161.8,15.95 161.8,15.72 157.68,11.61 156.31,11.61 TUBE6.3
  Bottom 0.254: v169.11,28.52 v169.11,54.81
N$97  (via drill 0.61)
  Top 0.254: v172.54,50.47 172.09,50.47 167.97,54.59 167.28,54.59 SHIFT6.24
  Bottom 0.254: v172.54,50.47 176.2,46.81 176.2,15.04 168.88,7.72 160.88,7.72 158.6,10.01 TUBE6.4
N$98  (via drill 0.61)
  Top 0.254: v172.54,49.1 168.43,53.21 167.28,53.21 SHIFT6.23
  Bottom 0.254: v172.54,49.1 172.54,22.81 173.46,21.89 173.46,18.47 172.31,17.32 169.34,17.32 161.34,9.32 TUBE6.5
N$99  (via drill 0.61)
  Top 0.254: SHIFT6.22 168.2,52.07 v173.46,46.81 | v175.28,44.98 175.28,15.95 168.2,8.87 164.31,8.87 164.08,9.09 TUBE6.6
  Bottom 0.254: v175.28,44.98 v173.46,46.81
N$100  (via drill 0.61)
  Top 0.254: v173.46,45.44 168.2,50.7 167.28,50.7 SHIFT6.21
  Bottom 0.254: v173.46,45.44 174.37,44.53 174.37,13.89 168.66,8.18 163.4,8.18 162.71,8.87 162.71,9.55 165.91,12.75 169.34,12.75 170.26,11.84 170.26,11.15 169.34,10.24 166.83,10.24 TUBE6.7
N$101  (via drill 0.61)
  Top 0.254: v173.46,44.07 168.2,49.33 167.28,49.33 SHIFT6.20
  Bottom 0.254: v173.46,44.07 173.46,22.58 173.91,22.12 173.91,14.12 168.66,8.87 166.37,8.87 165.46,9.78 165.46,10.46 166.37,11.38 168.88,11.38 TUBE6.8
N$102
  Top 0.254: SHIFT6.19 167.28,48.18 167.97,48.18 173.91,42.24 173.91,16.64 170.94,13.66 TUBE6.9
N$103
  Top 0.254: SHIFT6.18 167.28,46.81 168.2,46.81 173.46,41.55 173.46,17.78 172.09,16.41 TUBE6.10
N$104
  Top 0.254: SHIFT6.17 167.28,45.67 167.97,45.67 170.71,42.93 170.71,24.41 TUBE6.13
N$105  (via drill 0.61)
  Top 0.254: v162.48,41.78 158.6,45.67 157.91,45.67 SHIFT6.12
  Bottom 0.254: v162.48,41.78 162.48,33.78 168.88,27.38 168.88,26.7 TUBE6.14
N$106  (via drill 0.61)
  Top 0.254: v163.17,31.5 163.4,31.73 163.4,42.24 158.83,46.81 157.91,46.81 SHIFT6.11
  Bottom 0.254: v163.17,31.5 166.6,28.07 TUBE6.15
N$108
  Top 0.254: SHIFT6.10 157.91,48.18 158.6,48.18 164.08,42.7 164.08,28.98 TUBE6.16
N$115
  Top 0.254: SHIFT6.9 157.68,49.33 151.51,49.33 148.08,45.9 148.08,42.01 161.11,28.98 TUBE6.17
N$116  (via drill 0.61)
  Top 0.254: v151.05,50.7 157.68,50.7 SHIFT6.8 | v146.25,45.9 146.25,34.7 155.63,25.32 156.54,25.32 158.37,27.15 158.37,27.84 TUBE6.18
  Bottom 0.254: v146.25,45.9 v151.05,50.7
N$117
  Top 0.254: SHIFT6.7 151.05,52.07 147.62,48.64 147.62,36.07 156.08,27.61 156.08,26.7 TUBE6.19
N$118  (via drill 0.61)
  Top 0.254: v159.74,48.41 159.74,52.07 158.6,53.21 157.91,53.21 SHIFT6.6
  Bottom 0.254: v159.74,48.41 159.74,31.73 154.48,26.47 154.48,24.41 TUBE6.20
N$119  (via drill 0.61)
  Top 0.254: v152.88,29.44 147.17,35.15 147.17,48.87 152.88,54.59 157.68,54.59 SHIFT6.5
  Bottom 0.254: v152.88,29.44 152.88,21.89 TUBE6.21
N$120  (via drill 0.61)
  Top 0.254: v82.24,55.27 80.42,57.1 79.73,57.1 SHIFT3.26 | v71.5,15.49 68.3,15.49 66.7,13.89 TUBE3.2
  Bottom 0.254: v82.24,55.27 82.24,43.61 72.41,33.78 72.41,16.41 v71.5,15.49
N$121  (via drill 0.61)
  Top 0.254: v76.3,55.73 79.5,55.73 SHIFT3.25
  Bottom 0.254: v76.3,55.73 75.62,55.73 64.41,44.53 64.41,14.35 67.16,11.61 68.3,11.61 TUBE3.3
N$122  (via drill 0.61)
  Top 0.254: v81.33,53.9 80.64,54.59 79.73,54.59 SHIFT3.24 | v71.27,40.87 67.61,37.21 67.61,31.95 v68.76,30.81
  Bottom 0.254: v81.33,53.9 79.04,53.9 71.27,46.13 v71.27,40.87 | v68.76,30.81 68.76,28.3 67.39,26.92 67.39,25.32 67.84,24.87 67.84,23.72 66.93,22.81 66.93,15.04 70.81,11.15 70.81,10.24 TUBE3.4
N$123  (via drill 0.61)
  Top 0.254: v74.47,53.21 79.5,53.21 SHIFT3.23 | v66.93,28.52 66.93,25.78 67.84,24.87 v67.84,22.35
  Bottom 0.254: v74.47,53.21 74.47,52.76 66.93,45.21 v66.93,28.52 | v67.84,22.35 67.84,14.81 73.33,9.32 TUBE3.5
N$124  (via drill 0.61)
  Top 0.254: SHIFT3.22 79.04,52.07 v76.3,49.33
  Bottom 0.254: v76.3,49.33 76.3,38.35 71.96,34.01 71.96,17.32 70.59,15.95 70.59,14.58 75.84,9.32 76.3,9.32 TUBE3.6
N$125  (via drill 0.61)
  Top 0.254: v90.93,39.04 90.93,45.9 86.13,50.7 79.73,50.7 SHIFT3.21
  Bottom 0.254: v90.93,39.04 90.93,38.35 78.82,26.24 78.82,19.84 79.27,19.38 79.27,10.46 79.04,10.24 TUBE3.7
N$126  (via drill 0.61)
  Top 0.254: v83.16,20.3 83.16,22.12 88.88,27.84 88.88,45.21 84.76,49.33 79.73,49.33 SHIFT3.20
  Bottom 0.254: v83.16,20.3 83.16,15.26 84.3,14.12 84.3,13.21 82.7,11.61 81.56,11.61 TUBE3.8
N$127  (via drill 0.61)
  Top 0.254: v77.9,48.18 79.5,48.18 SHIFT3.19 | v77.9,41.33 77.9,40.64 82.47,36.07 82.47,25.32 82.02,24.87 v82.02,19.38
  Bottom 0.254: v77.9,41.33 v77.9,48.18 | v82.02,19.38 82.02,15.04 83.16,13.89 TUBE3.9
N$128  (via drill 0.61)
  Top 0.254: v74.24,50.47 74.24,50.01 77.22,47.04 79.5,47.04 SHIFT3.18 | v69.22,19.15 72.41,15.95 72.41,15.72 72.64,15.49 74.02,15.49 75.62,17.09 75.62,17.32 76.3,18.01 82.7,18.01 84.3,16.41 TUBE3.10
  Bottom 0.254: v74.24,50.47 74.24,49.78 70.36,45.9 70.36,29.9 69.22,28.75 69.22,27.38 69.67,26.92 69.67,19.61 v69.22,19.15
N$129
  Top 0.254: SHIFT3.17 79.73,45.67 87.73,45.67 88.42,44.98 88.42,29.44 83.39,24.41 TUBE3.13
N$130
  Top 0.254: SHIFT3.12 70.36,45.67 71.04,45.67 77.9,38.81 77.9,27.61 78.82,26.7 81.33,26.7 TUBE3.14
N$131
  Top 0.254: SHIFT3.11 70.36,46.81 71.04,46.81 78.82,39.04 78.82,28.07 TUBE3.15
N$132  (via drill 0.61)
  Top 0.254: v68.53,39.5 68.53,47.27 69.44,48.18 70.13,48.18 SHIFT3.10 | v74.24,31.04 v68.53,36.75
  Bottom 0.254: v68.53,36.75 v68.53,39.5 | v74.24,31.04 76.3,28.98 TUBE3.16
N$134
  Top 0.254: SHIFT3.9 70.13,49.33 69.44,49.33 67.16,47.04 67.16,31.04 68.3,29.9 72.41,29.9 73.33,28.98 TUBE3.17
N$136
  Top 0.254: SHIFT3.8 70.13,50.7 69.44,50.7 60.53,41.78 60.53,35.84 66.93,29.44 69.44,29.44 70.81,28.07 TUBE3.18
N$137  (via drill 0.61)
  Top 0.254: SHIFT3.7 70.81,52.07 72.87,50.01 v72.87,46.36
  Bottom 0.254: v72.87,46.36 72.87,35.61 70.81,33.55 70.81,29.67 69.67,28.52 69.67,27.61 70.13,27.15 70.13,18.69 69.67,18.24 68.76,18.24 68.3,18.69 68.3,21.44 68.76,21.89 68.76,26.24 68.53,26.47 TUBE3.19
N$138
  Top 0.254: SHIFT3.6 70.13,53.21 69.44,53.21 60.07,43.84 60.07,30.81 66.47,24.41 TUBE3.20
N$139  (via drill 0.61)
  Top 0.254: v72.41,54.59 70.36,54.59 SHIFT3.5
  Bottom 0.254: v72.41,54.59 73.79,54.59 75.84,56.64 76.76,56.64 77.22,56.19 77.22,54.59 74.02,51.38 73.79,51.38 69.9,47.5 69.9,33.33 67.84,31.27 67.84,28.07 65.56,25.78 65.56,21.89 TUBE3.21
N$140  (via drill 0.61)
  Top 0.254: v115.16,39.95 115.16,51.61 109.68,57.1 108.99,57.1 SHIFT4.26 | v107.16,20.52 107.16,16.18 106.48,15.49 105.1,15.49 103.73,16.87 103.73,17.78 103.28,18.24 101.22,18.24 96.88,13.89 95.96,13.89 TUBE4.2
  Bottom 0.254: v115.16,39.95 115.16,36.75 107.16,28.75 v107.16,20.52
N$141  (via drill 0.61)
  Top 0.254: v101.22,49.1 107.85,55.73 108.76,55.73 SHIFT4.25 | v97.56,34.24 v97.56,45.44 | v98.93,18.01 v98.93,20.52
  Bottom 0.254: v97.56,45.44 v101.22,49.1 | v97.56,34.24 97.56,28.3 98.93,26.92 v98.93,20.52 | v98.93,18.01 98.93,12.75 97.79,11.61 TUBE4.3
N$142  (via drill 0.61)
  Top 0.254: v116.08,37.67 114.25,39.5 114.25,49.78 109.45,54.59 108.99,54.59 SHIFT4.24 | v108.76,20.52 108.76,18.92 v108.08,18.24
  Bottom 0.254: v116.08,37.67 116.08,36.98 109.45,30.35 109.45,27.61 108.76,26.92 v108.76,20.52 | v108.08,18.24 100.08,10.24 TUBE4.4
N$143  (via drill 0.61)
  Top 0.254: v110.36,28.07 105.1,33.33 105.1,50.24 108.08,53.21 108.76,53.21 SHIFT4.23 | v110.13,20.52 110.13,17.55 113.56,14.12 113.56,13.21 112.88,12.52 111.96,12.52 111.28,13.21 106.7,13.21 102.82,9.32 TUBE4.5
  Bottom 0.254: v110.36,28.07 109.91,27.61 109.91,27.38 109.45,26.92 109.45,21.21 v110.13,20.52
N$144  (via drill 0.61)
  Top 0.254: SHIFT4.22 108.08,52.07 105.56,49.55 105.56,36.52 v111.51,30.58 | v116.53,20.98 116.53,15.49 113.11,12.06 111.73,12.06 111.05,12.75 108.99,12.75 105.56,9.32 TUBE4.6
  Bottom 0.254: v111.51,30.58 116.53,25.55 v116.53,20.98
N$145  (via drill 0.61)
  Top 0.254: v106.93,49.55 108.08,50.7 108.76,50.7 SHIFT4.21 | v90.02,40.64 v90.02,45.44 | v101.45,7.72 v76.3,7.72
  Bottom 0.254: v106.93,49.55 102.13,49.55 99.16,52.53 97.1,52.53 v90.02,45.44 | v90.02,40.64 77.44,28.07 77.44,8.87 v76.3,7.72 | v101.45,7.72 105.79,7.72 108.08,10.01 TUBE4.7
N$146  (via drill 0.61)
  Top 0.254: v112.88,42.01 113.79,42.93 113.79,45.21 109.68,49.33 108.99,49.33 SHIFT4.20 | v100.76,20.75 102.36,19.15 104.42,19.15 v104.88,18.69 | v103.28,14.81 103.28,11.38 101.68,9.78 101.68,8.87 102.36,8.18 107.85,8.18 110.36,10.69 110.36,11.38 TUBE4.8
  Bottom 0.254: v112.88,42.01 111.73,42.01 106.7,36.98 106.7,26.7 v100.76,20.75 | v104.88,18.69 104.88,16.41 v103.28,14.81
N$147  (via drill 0.61)
  Top 0.254: v112.88,43.38 112.88,44.98 109.68,48.18 108.99,48.18 SHIFT4.19 | v81.1,16.64 81.79,16.64 85.9,12.52 96.65,12.52 101.91,17.78 103.05,17.78 103.28,17.55 103.28,16.64 106.02,13.89 112.42,13.89 TUBE4.9
  Bottom 0.254: v112.88,43.38 112.19,43.38 107.39,38.58 91.85,38.58 79.27,26.01 79.27,20.07 81.1,18.24 v81.1,16.64
N$148  (via drill 0.61)
  Top 0.254: v113.56,27.15 113.56,34.7 106.02,42.24 106.02,44.98 107.85,46.81 108.76,46.81 SHIFT4.18 | v111.51,20.98 111.51,18.47 113.56,16.41 TUBE4.10
  Bottom 0.254: v113.56,27.15 113.56,23.49 111.51,21.44 v111.51,20.98
N$149  (via drill 0.61)
  Top 0.254: v111.96,40.87 111.96,43.38 109.68,45.67 108.99,45.67 SHIFT4.17 | v111.96,34.92 111.96,31.5 112.42,31.04 v112.42,26.47
  Bottom 0.254: v111.96,34.92 v111.96,40.87 | v112.42,26.47 112.42,24.41 TUBE4.13
N$150
  Top 0.254: SHIFT4.12 99.62,45.67 100.08,45.67 104.19,41.55 104.19,29.67 104.42,29.44 104.42,28.3 106.02,26.7 110.36,26.7 TUBE4.14
N$151
  Top 0.254: SHIFT4.11 99.62,46.81 101.91,46.81 104.65,44.07 104.65,31.5 108.08,28.07 TUBE4.15
N$152  (via drill 0.61)
  Top 0.254: v96.65,37.67 96.65,46.13 98.7,48.18 99.39,48.18 SHIFT4.10
  Bottom 0.254: v96.65,37.67 105.33,28.98 TUBE4.16
N$153
  Top 0.254: SHIFT4.9 99.39,49.33 98.48,49.33 95.73,46.58 95.73,34.7 101.45,28.98 102.59,28.98 TUBE4.17
N$154
  Top 0.254: SHIFT4.8 99.39,50.7 98.7,50.7 93.9,45.9 93.9,34.01 99.85,28.07 TUBE4.18
N$156  (via drill 0.61)
  Top 0.254: SHIFT4.7 98.02,52.07 v97.56,51.61 | v94.82,45.44 94.82,34.92 101.22,28.52 101.22,27.61 100.3,26.7 97.79,26.7 TUBE4.19
  Bottom 0.254: v97.56,51.61 97.56,48.18 v94.82,45.44
N$158
  Top 0.254: L1.2-DOUT 14.12,17.55 16.41,17.55 17.78,18.92 24.64,18.92 26.01,20.3 31.5,20.3 32.18,19.61 42.24,19.61 44.07,21.44 L2.4-DIN
N$159
  Top 0.254: SHIFT4.6 99.39,53.21 97.79,53.21 92.53,47.95 92.53,27.61 95.73,24.41 TUBE4.20
N$160  (via drill 0.61)
  Top 0.254: v92.07,24.41 92.07,48.18 98.48,54.59 99.39,54.59 SHIFT4.5
  Bottom 0.254: v92.07,24.41 94.59,21.89 TUBE4.21
N$161  (via drill 0.61)
  Top 0.254: v15.72,57.56 15.95,57.33 21.21,57.33 SHIFT1.26
  Bottom 0.254: v15.72,57.56 15.72,61.21 14.12,62.81 13.21,62.81 5.89,55.5 5.89,15.95 8.18,13.66 TUBE1.2
N$162  (via drill 0.61)
  Top 0.254: v27.61,50.24 22.12,55.73 21.44,55.73 SHIFT1.25 | v39.27,18.69 39.27,17.78 36.3,14.81 13.44,14.81 10.24,11.61 TUBE1.3
  Bottom 0.254: v27.61,50.24 27.61,42.7 37.21,33.1 37.21,25.78 36.3,24.87 36.3,23.49 39.27,20.52 v39.27,18.69
N$163  (via drill 0.61)
  Top 0.254: v26.24,50.24 21.89,54.59 21.44,54.59 SHIFT1.24
  Bottom 0.254: v26.24,50.24 26.24,41.33 36.3,31.27 36.3,30.35 28.98,23.04 25.55,23.04 24.87,22.35 24.87,18.92 27.15,16.64 27.15,14.12 21.21,8.18 17.55,8.18 16.18,9.55 16.18,9.78 15.49,10.46 12.75,10.46 12.52,10.24 TUBE1.4
N$164  (via drill 0.61)
  Top 0.254: v13.66,55.5 15.72,53.44 21.21,53.44 SHIFT1.23
  Bottom 0.254: v13.66,55.5 13.66,54.81 10.92,52.07 10.92,29.67 7.04,25.78 7.04,23.49 9.09,21.44 9.09,14.35 11.15,12.29 11.15,9.78 12.06,8.87 14.81,8.87 15.04,9.09 TUBE1.5
N$165  (via drill 0.61)
  Top 0.254: SHIFT1.22 20.52,52.07 v19.38,50.93
  Bottom 0.254: v19.38,50.93 14.58,46.13 14.58,43.38 11.84,40.64 11.84,29.9 8.87,26.92 8.87,25.32 9.55,24.64 9.55,15.72 14.35,10.92 16.18,10.92 17.78,9.32 TUBE1.6
N$166  (via drill 0.61)
  Top 0.254: v19.38,49.55 20.52,50.7 21.21,50.7 SHIFT1.21
  Bottom 0.254: v19.38,49.55 19.38,36.52 11.15,28.3 11.15,20.75 10.01,19.61 10.01,15.95 14.58,11.38 19.38,11.38 20.52,10.24 TUBE1.7
N$167  (via drill 0.61)
  Top 0.254: v22.35,19.84 31.73,29.21 31.73,45.44 27.84,49.33 21.44,49.33 SHIFT1.20
  Bottom 0.254: v22.35,19.84 22.35,12.06 22.81,11.61 TUBE1.8
N$168  (via drill 0.61)
  Top 0.254: v27.84,27.61 31.27,31.04 31.27,45.21 28.3,48.18 21.44,48.18 SHIFT1.19
  Bottom 0.254: v27.84,27.61 25.09,27.61 24.18,26.7 24.18,26.01 23.27,25.09 23.27,15.26 24.64,13.89 TUBE1.9
N$169  (via drill 0.61)
  Top 0.254: v25.55,26.7 30.81,31.95 30.81,44.98 28.98,46.81 21.44,46.81 SHIFT1.18
  Bottom 0.254: v25.55,26.7 23.72,24.87 23.72,18.47 25.78,16.41 TUBE1.10
N$170
  Top 0.254: SHIFT1.17 21.21,45.67 20.52,45.67 19.84,44.98 19.84,40.41 24.64,35.61 24.64,24.41 TUBE1.13
N$171
  Top 0.254: SHIFT1.12 11.84,45.67 13.89,45.67 23.04,36.52 23.04,26.7 TUBE1.14
N$172
  Top 0.254: SHIFT1.11 11.61,46.81 10.92,46.81 9.09,44.98 9.09,39.5 20.52,28.07 TUBE1.15
N$173
  Top 0.254: SHIFT1.10 11.61,48.18 11.15,48.18 8.64,45.67 8.64,38.12 17.78,28.98 TUBE1.16
N$174
  Top 0.254: SHIFT1.9 11.61,49.33 10.92,49.33 8.18,46.58 8.18,35.84 15.04,28.98 TUBE1.17
N$175
  Top 0.254: SHIFT1.8 11.61,50.7 10.92,50.7 7.72,47.5 7.72,32.64 12.29,28.07 TUBE1.18
N$176
  Top 0.254: SHIFT1.7 11.15,52.07 7.26,48.18 7.26,29.44 10.01,26.7 TUBE1.19
N$178
  Top 0.254: SHIFT1.6 11.61,53.21 10.92,53.21 6.81,49.1 6.81,25.78 8.18,24.41 TUBE1.20
N$179
  Top 0.254: L2.2-DOUT 47.5,16.64 51.61,16.64 55.73,20.75 72.41,20.75 73.1,21.44 L3.4-DIN
N$180
  Top 0.254: L3.2-DOUT 76.76,16.64 79.73,16.64 80.64,17.55 81.56,17.55 84.07,15.04 97.33,15.04 100.99,18.69 103.5,18.69 105.56,16.64 L4.4-DIN
N$181
  Top 0.254: SHIFT1.5 11.61,54.59 11.15,54.59 4.06,47.5 4.06,24.87 7.04,21.89 TUBE1.21
N$182  (via drill 0.61)
  Top 0.254: v42.93,50.24 49.78,57.1 50.24,57.1 SHIFT2.26 | v33.78,45.44 33.78,31.95 32.64,30.81 v32.64,20.52
  Bottom 0.254: v42.93,50.24 42.93,49.78 38.35,45.21 34.01,45.21 v33.78,45.44 | v32.64,20.52 32.64,18.24 37.21,13.66 TUBE2.2
N$183  (via drill 0.61)
  Top 0.254: v45.67,51.61 45.67,51.84 49.55,55.73 50.24,55.73 SHIFT2.25 | v37.21,51.61 34.7,49.1 34.7,32.18 34.01,31.5 v34.01,20.52
  Bottom 0.254: v37.21,51.61 v45.67,51.61 | v34.01,20.52 34.01,20.07 39.27,14.81 TUBE2.3
N$184  (via drill 0.61)
  Top 0.254: v58.47,43.84 58.47,47.27 51.16,54.59 50.47,54.59 SHIFT2.24
  Bottom 0.254: v58.47,43.84 58.47,42.47 58.01,42.01 58.01,23.04 45.44,10.46 42.01,10.46 41.78,10.24 TUBE2.4
N$185  (via drill 0.61)
  Top 0.254: v48.18,27.61 48.18,29.44 46.81,30.81 46.81,50.47 49.55,53.21 50.24,53.21 SHIFT2.23 | v45.21,18.01 45.21,10.01 44.53,9.32 TUBE2.5
  Bottom 0.254: v48.18,27.61 48.18,20.98 v45.21,18.01
N$186  (via drill 0.61)
  Top 0.254: SHIFT2.22 51.16,52.07 v56.64,46.58 | v51.84,22.12 49.78,22.12 46.13,18.47 46.13,10.24 47.04,9.32 TUBE2.6
  Bottom 0.254: v56.64,46.58 56.64,28.52 51.84,23.72 v51.84,22.12
N$187  (via drill 0.61)
  Top 0.254: v48.64,49.78 49.55,50.7 50.24,50.7 SHIFT2.21 | v47.27,18.24 46.58,17.55 46.58,13.44 49.78,10.24 TUBE2.7
  Bottom 0.254: v48.64,49.78 48.64,45.9 50.93,43.61 50.93,21.89 v47.27,18.24
N$188  (via drill 0.61)
  Top 0.254: v59.16,41.78 51.61,49.33 50.47,49.33 SHIFT2.20 | v57.33,15.49 53.44,11.61 52.3,11.61 TUBE2.8
  Bottom 0.254: v59.16,41.78 61.21,39.73 61.21,19.38 v57.33,15.49
N$189  (via drill 0.61)
  Top 0.254: v59.16,40.41 51.38,48.18 50.47,48.18 SHIFT2.19 | v60.3,19.84 54.13,13.66 TUBE2.9
  Bottom 0.254: v59.16,40.41 59.16,30.81 60.3,29.67 v60.3,19.84
N$190  (via drill 0.61)
  Top 0.254: v59.38,23.95 59.38,38.81 51.38,46.81 50.47,46.81 SHIFT2.18 | v57.33,18.47 55.27,16.41 TUBE2.10
  Bottom 0.254: v59.38,23.95 59.38,20.52 v57.33,18.47
N$191
  Top 0.254: SHIFT2.17 50.47,45.67 51.16,45.67 53.9,42.93 53.9,24.41 TUBE2.13
N$192
  Top 0.254: SHIFT2.12 41.1,45.67 41.78,45.67 45.9,41.55 45.9,28.52 47.73,26.7 52.07,26.7 TUBE2.14
N$193  (via drill 0.61)
  Top 0.254: v45.44,43.38 42.01,46.81 41.1,46.81 SHIFT2.11
  Bottom 0.254: v45.44,43.38 45.44,32.41 49.78,28.07 TUBE2.15
N$194
  Top 0.254: SHIFT2.10 41.1,48.18 42.01,48.18 46.36,43.84 46.36,29.67 47.04,28.98 TUBE2.16
N$195
  Top 0.254: SHIFT2.9 40.87,49.33 39.73,49.33 38.12,47.73 38.12,44.53 37.44,43.84 37.44,35.15 43.61,28.98 44.3,28.98 TUBE2.17
N$196  (via drill 0.61)
  Top 0.254: v39.04,50.01 39.73,50.7 40.87,50.7 SHIFT2.8 | v39.04,47.27 39.04,44.76 38.35,44.07 v38.35,35.61
  Bottom 0.254: v39.04,47.27 v39.04,50.01 | v38.35,35.61 38.35,31.27 41.55,28.07 TUBE2.18
N$197
  Top 0.254: SHIFT2.7 39.73,52.07 38.12,50.47 38.12,48.41 35.15,45.44 35.15,31.95 34.47,31.27 34.47,30.35 38.12,26.7 39.27,26.7 TUBE2.19
N$198  (via drill 0.61)
  Top 0.254: v37.21,50.24 40.18,53.21 40.87,53.21 SHIFT2.6 | v37.21,46.13 37.21,44.3 36.52,43.61 v36.52,35.15
  Bottom 0.254: v37.21,46.13 v37.21,50.24 | v36.52,35.15 36.52,34.47 37.67,33.33 37.67,24.64 37.44,24.41 TUBE2.20
N$200  (via drill 0.61)
  Top 0.254: v32.87,36.07 32.87,52.07 35.38,54.59 40.87,54.59 SHIFT2.5
  Bottom 0.254: v32.87,36.07 32.87,35.38 36.75,31.5 36.75,26.01 35.84,25.09 35.84,22.12 36.07,21.89 TUBE2.21
N$201
  Top 0.254: L4.2-DOUT 102.59,21.67 104.19,21.67 105.33,22.81 112.88,22.81 113.79,23.72 124.08,23.72 126.14,21.67 131.62,21.67 L5.4-DIN
N$202  (via drill 0.61)
  Top 0.254: v136.42,18.01 135.05,16.64 L5.2-DOUT | v158.14,18.01 158.14,18.69 160.88,21.44 L6.4-DIN
  Bottom 0.254: v158.14,18.01 v136.42,18.01
N$225
  Top 0.254: TUBE2.1 36.07,16.41 28.98,16.41 26.47,18.92 TUBE1.11
N$227
  Top 0.254: TUBE4.1 94.59,16.41 87.5,16.41 84.99,18.92 TUBE3.11
PB0
  Bottom 0.254: JPB.2 25.32,76.3 25.32,81.1 R2.2 25.55,81.33 31.73,87.5 31.73,88.88 U1.14
PB2
  Top 0.254: JPB.4 34.24,79.96 34.24,81.1 U1.16
PB3
  Top 0.254: U1.17 36.75,81.1 36.75,79.96 33.1,76.3 JPB.5
PB4
  Top 0.254: U1.18 39.27,81.1 39.27,79.96 35.61,76.3 JPB.6
PB5
  Top 0.254: U1.19 41.78,81.1 41.78,79.96 38.12,76.3 JPB.7
PC4
  Top 0.254: JPA.2 50.93,73.79 54.36,73.79 61.67,81.1 62.13,81.1 U1.27
PC5
  Top 0.254: U1.28 64.64,81.1 64.64,74.7 62.36,72.41 JPA.7
PD3
  Bottom 0.254: U1.5 54.59,89.1 54.59,97.79 48.18,104.19 33.1,104.19 31.95,103.05 JPD.2
PD4
  Bottom 0.254: U1.6 52.07,99.62 49.78,101.91 35.15,101.91 34.7,101.45 30.58,101.45 29.21,102.82 JPD.3
PD5
  Top 0.254: U1.11 39.27,89.1 39.27,90.25 26.7,102.82 JPD.4
PD6
  Top 0.254: JPD.5 36.75,90.25 36.75,89.1 U1.12
PD7
  Top 0.254: U1.13 34.24,89.1 34.24,90.25 21.67,102.82 JPD.6
VCC
  Top 0.254: 106.7,96.42 C8.+ 106.48,96.65 | 94.13,96.65 IC1.3 | 47.04,83.84 44.53,81.33 U1.20 | 47.04,83.84 49.33,86.13 49.33,88.88 U1.7 | 47.04,83.84 43.38,87.5 43.38,89.56 34.47,98.48 34.47,102.82 JPD.1 | JPA.6 59.61,72.19 58.93,72.19 57.79,71.04 48.18,71.04 47.04,72.19 JPA.1 46.81,72.41 27.38,72.41 23.72,76.07 23.04,76.07 JPB.1
  Top 0.61: R4.2 109.22,93.9 106.7,96.42 | 106.48,96.65 94.13,96.65
  Bottom 0.254: 12.98,76.3 12.98,73.33 13.89,72.41 R1.2 | 12.98,76.3 12.98,85.67 15.04,87.73 15.04,92.53 C3.1 | 12.98,76.3 22.81,76.3 JPB.1 | U1.20 44.53,81.1 47.04,78.59 47.04,77.67 C4.1 47.04,77.44 47.04,72.41 JPA.1 | U1.7 51.38,87.05 55.04,87.05 55.73,87.73 55.73,89.56 61.21,95.05 61.21,96.88 65.56,101.22 87.05,101.22 91.62,96.65 93.9,96.65 IC1.3
VFIL  (via drill 0.61)
  Top 0.254: 76.53,81.33 R5.2 | 84.99,81.33 IC2.3 | 63.96,14.81 65.33,16.18 TUBE3.1 | 63.96,14.81 59.38,10.24 | 59.38,10.24 57.33,8.18 11.84,8.18 7.04,12.98 7.04,16.18 TUBE1.1 | 59.38,10.24 64.41,5.21 106.93,5.21 117.91,16.18 123.85,16.18 TUBE5.1 | v72.19,14.35 68.76,14.35 66.93,12.52 66.24,12.52 63.96,14.81
  Top 0.61: 84.99,81.33 76.53,81.33
  Bottom 0.254: 86.59,79.73 85.22,81.1 IC2.3 | 86.59,79.73 87.5,78.82 96.42,78.82 C7.+ | 86.59,79.73 83.16,76.3 83.16,43.84 73.33,34.01 73.33,30.58 74.7,29.21 74.7,16.87 v72.19,14.35
(copper drawn outside any net)
  shapes: Top area x2